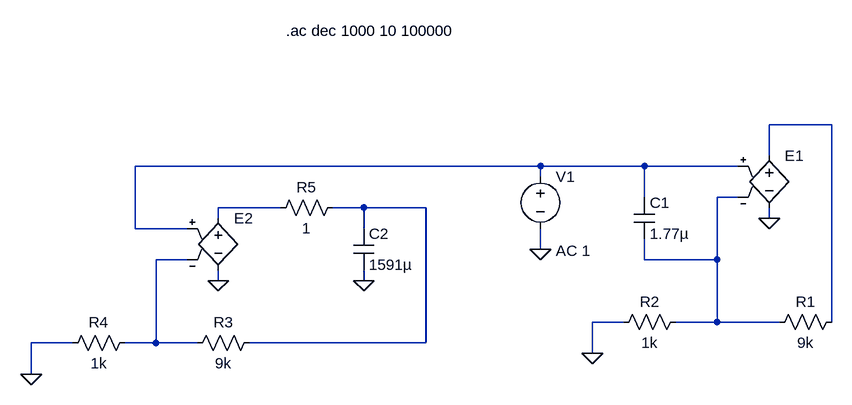
[diagram p0: schematic polo.asc]
polo.asc, the LTspice schematic file:
Version 4
SHEET 1 1748 680
WIRE 944 32 848 32
WIRE 848 80 848 32
WIRE 496 96 -128 96
WIRE 656 96 496 96
WIRE 800 96 656 96
WIRE 496 112 496 96
WIRE 656 144 656 96
WIRE 800 144 768 144
WIRE 96 160 0 160
WIRE 224 160 176 160
WIRE 320 160 224 160
WIRE 0 176 0 160
WIRE 848 176 848 160
WIRE -128 192 -128 96
WIRE -48 192 -128 192
WIRE 224 192 224 160
WIRE 496 224 496 192
WIRE -48 240 -96 240
WIRE 656 240 656 208
WIRE 768 240 768 144
WIRE 768 240 656 240
WIRE 0 272 0 256
WIRE 224 272 224 256
WIRE 624 336 576 336
WIRE 768 336 768 240
WIRE 768 336 704 336
WIRE 864 336 768 336
WIRE 944 336 944 32
WIRE -224 368 -288 368
WIRE -96 368 -96 240
WIRE -96 368 -144 368
WIRE -32 368 -96 368
WIRE 320 368 320 160
WIRE 320 368 48 368
WIRE 576 384 576 336
WIRE -288 416 -288 368
FLAG 576 384 0
FLAG 848 176 0
FLAG 496 224 0
FLAG 224 272 0
FLAG -288 416 0
FLAG 0 272 0
SYMBOL e 848 64 R0
WINDOW 3 24 96 Invisible 2
SYMATTR Value 990
SYMATTR InstName E1
SYMBOL res 960 320 R90
WINDOW 0 0 56 VBottom 2
WINDOW 3 32 56 VTop 2
SYMATTR InstName R1
SYMATTR Value 9k
SYMBOL res 720 320 R90
WINDOW 0 0 56 VBottom 2
WINDOW 3 32 56 VTop 2
SYMATTR InstName R2
SYMATTR Value 1k
SYMBOL voltage 496 96 R0
WINDOW 123 24 130 Left 2
WINDOW 39 0 0 Left 2
SYMATTR Value2 AC 1
SYMATTR InstName V1
SYMATTR Value ""
SYMBOL cap 640 144 R0
SYMATTR InstName C1
SYMATTR Value 1.77µ
SYMBOL e 0 160 R0
WINDOW 3 24 96 Invisible 2
SYMATTR Value 990
SYMATTR InstName E2
SYMBOL res 64 352 R90
WINDOW 0 0 56 VBottom 2
WINDOW 3 32 56 VTop 2
SYMATTR InstName R3
SYMATTR Value 9k
SYMBOL res -128 352 R90
WINDOW 0 0 56 VBottom 2
WINDOW 3 32 56 VTop 2
SYMATTR InstName R4
SYMATTR Value 1k
SYMBOL res 192 144 R90
WINDOW 0 0 56 VBottom 2
WINDOW 3 32 56 VTop 2
SYMATTR InstName R5
SYMATTR Value 1
SYMBOL cap 208 192 R0
SYMATTR InstName C2
SYMATTR Value 1591µ
TEXT 104 -112 Left 2 !.ac dec 1000 10 100000

The netlist it stands for:
* polo.asc
E1 N001 0 N002 N003 990
R1 N001 N003 9k
R2 N003 0 1k
V1 N002 0 AC 1
C1 N002 N003 1.77µ
E2 N004 0 N002 N006 990
R3 N005 N006 9k
R4 N006 0 1k
R5 N005 N004 1
C2 N005 0 1591µ
.ac dec 1000 10 100000
.backanno
.end